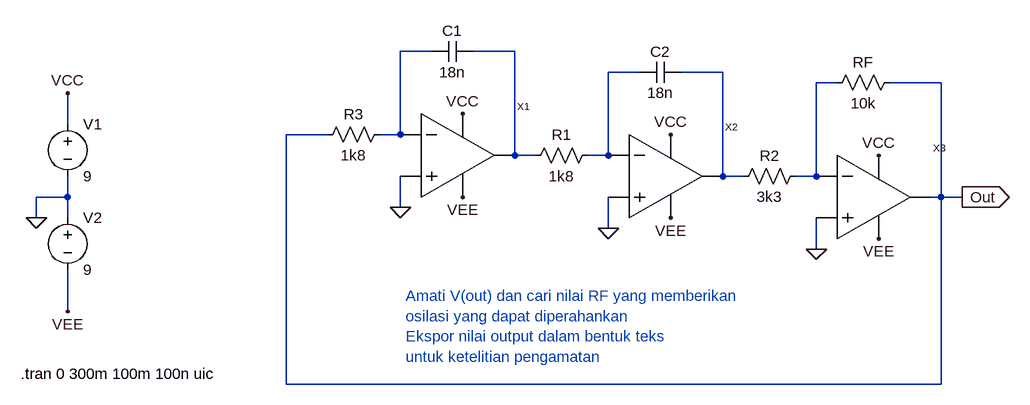
[diagram p0: schematic Perc-4-3-Quadrature.asc]
Perc-4-3-Quadrature.asc, the LTspice schematic file:
Version 4
SHEET 1 1284 680
WIRE 368 -16 320 -16
WIRE 496 -16 432 -16
WIRE 688 16 640 16
WIRE 816 16 752 16
WIRE 992 32 960 32
WIRE 1152 32 1072 32
WIRE -192 96 -192 48
WIRE 208 112 144 112
WIRE 320 112 320 -16
WIRE 320 112 288 112
WIRE 496 144 496 -16
WIRE 528 144 496 144
WIRE 640 144 640 16
WIRE 640 144 608 144
WIRE 816 176 816 16
WIRE 848 176 816 176
WIRE 960 176 960 32
WIRE 960 176 928 176
WIRE -192 208 -192 176
WIRE -192 208 -240 208
WIRE 1152 208 1152 32
WIRE 1152 208 1136 208
WIRE 1184 208 1152 208
WIRE 320 224 320 176
WIRE -240 240 -240 208
WIRE -192 240 -192 208
WIRE 640 256 640 208
WIRE 960 288 960 240
WIRE -192 384 -192 320
WIRE 144 496 144 112
WIRE 1152 496 1152 208
WIRE 1152 496 144 496
FLAG -240 240 0
FLAG -192 48 VCC
FLAG -192 384 VEE
FLAG 320 224 0
FLAG 640 256 0
FLAG 960 288 0
FLAG 416 80 VCC
FLAG 736 112 VCC
FLAG 1056 144 VCC
FLAG 736 240 VEE
FLAG 1056 272 VEE
FLAG 416 208 VEE
FLAG 1184 208 Out
IOPIN 1184 208 Out
SYMBOL voltage -192 80 R0
WINDOW 123 0 0 Left 0
WINDOW 39 0 0 Left 0
SYMATTR InstName V1
SYMATTR Value 9
SYMBOL voltage -192 224 R0
WINDOW 123 0 0 Left 0
WINDOW 39 0 0 Left 0
SYMATTR InstName V2
SYMATTR Value 9
SYMBOL Opampku 720 176 R0
SYMATTR InstName X2
SYMBOL Opampku 1040 208 R0
SYMATTR InstName X3
SYMBOL res 624 128 R90
WINDOW 0 0 56 VBottom 2
WINDOW 3 32 56 VTop 2
SYMATTR InstName R1
SYMATTR Value 1k8
SYMBOL res 944 160 R90
WINDOW 0 0 56 VBottom 2
WINDOW 3 32 56 VTop 2
SYMATTR InstName R2
SYMATTR Value 3k3
SYMBOL res 304 96 R90
WINDOW 0 0 56 VBottom 2
WINDOW 3 32 56 VTop 2
SYMATTR InstName R3
SYMATTR Value 1k8
SYMBOL cap 432 -32 R90
WINDOW 0 0 32 VBottom 2
WINDOW 3 32 32 VTop 2
SYMATTR InstName C1
SYMATTR Value 18n
SYMBOL cap 752 0 R90
WINDOW 0 0 32 VBottom 2
WINDOW 3 32 32 VTop 2
SYMATTR InstName C2
SYMATTR Value 18n
SYMBOL Opampku 400 144 R0
SYMATTR InstName X1
SYMBOL res 1088 16 R90
WINDOW 0 0 56 VBottom 2
WINDOW 3 32 56 VTop 2
SYMATTR InstName RF
SYMATTR Value 10k
TEXT -264 480 Left 2 !.tran 0 300m 100m 100n uic
TEXT 328 360 Left 2 ;Amati V(out) dan cari nilai RF yang memberikan \nosilasi yang dapat diperahankan\nEkspor nilai output dalam bentuk teks \nuntuk ketelitian pengamatan

The netlist it stands for:
* Perc-4-3-Quadrature.asc
V1 VCC 0 9
V2 0 VEE 9
XX2 N003 0 VCC VEE N004 Opampku  ; pins inn inp vp vn out
XX3 N005 0 VCC VEE Out Opampku  ; pins inn inp vp vn out
R1 N003 N002 1k8
R2 N005 N004 3k3
R3 N001 Out 1k8
C1 N002 N001 18n
C2 N004 N003 18n
XX1 N001 0 VCC VEE N002 Opampku  ; pins inn inp vp vn out
RF Out N005 10k
.tran 0 300m 100m 100n uic
* Amati V(out) dan cari nilai RF yang memberikan
* osilasi yang dapat diperahankan
* Ekspor nilai output dalam bentuk teks
* untuk ketelitian pengamatan
.backanno
.end